# EAGLE schematic Training_Board (EAGLE 9.1.1)
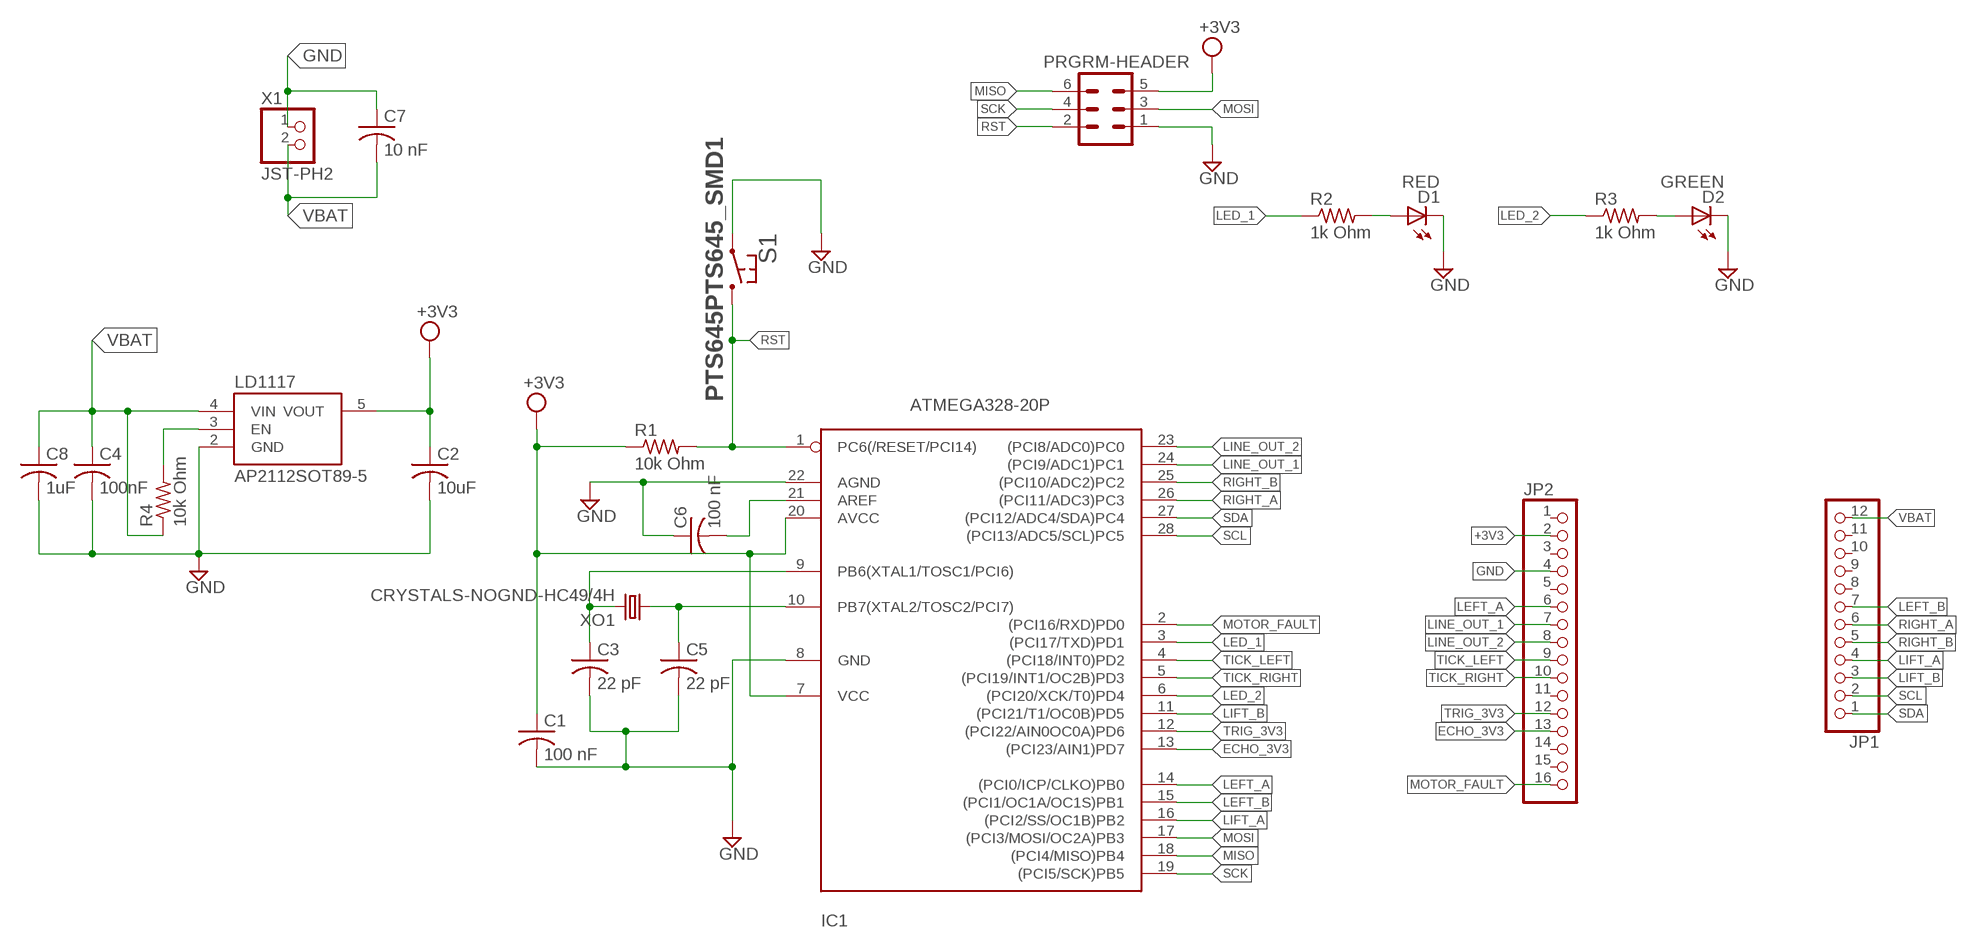
[diagram p0: schematic, sheet 1]

## Parts
C1  100 nF  C-USC0603  [C0603]
C2  10uF  C-USC0603  [C0603]
C3  22 pF  C-USC0603  [C0603]
C4  100nF  C-USC0603  [C0603]
C5  22 pF  C-USC0603  [C0603]
C6  100 nF  C-USC0603  [C0603]
C7  10 nF  C-USC0603  [C0603]
C8  1uF  C-USC0603  [C0603]
D1  RED  LEDCHIP-LED0603  [CHIP-LED0603]
D2  GREEN  LEDCHIP-LED0603  [CHIP-LED0603]
IC1  ATMEGA328-20P  [DIL28-3]
JP1  PINHD-1X12  [1X12]
JP2  PINHD-1X16  [1X16]
LD1117  AP2112SOT89-5  [SOT95P285X110-5]
PRGRM-HEADER  MA03-2  [MA03-2]
R1  10k Ohm  R-US_R0603  [R0603]
R2  1k Ohm  R-US_M0805  [M0805]
R3  1k Ohm  R-US_M0805  [M0805]
R4  10k Ohm  R-US_M0805  [M0805]
S1  PTS645PTS645_SMD1  [PTS645_SMD]
X1  JST-PH2  [JST-PH]
XO1  CRYSTALS-NOGND-HC49/4H  [HC49]

## Nets
+3V3: C1.1 C2.1 IC1.7(VCC) IC1.20(AVCC) JP2.2 LD1117.5(VOUT) PRGRM-HEADER.5 R1.1
ECHO_3V3: IC1.13((PCI23/AIN1)PD7) JP2.13
GND: C1.2 C2.2 C3.2 C4.2 C5.2 C6.1 C7.1 C8.2 D1.C D2.C IC1.8(GND) IC1.22(AGND) JP2.4 LD1117.2(GND) PRGRM-HEADER.1 S1.P$1 S1.P$2 X1.1
LED_1: IC1.3((PCI17/TXD)PD1) R2.1
LED_2: IC1.6((PCI20/XCK/T0)PD4) R3.1
LEFT_A: IC1.14((PCI0/ICP/CLKO)PB0) JP2.6
LEFT_B: IC1.15((PCI1/OC1A/OC1S)PB1) JP1.7
LIFT_A: IC1.16((PCI2/SS/OC1B)PB2) JP1.4
LIFT_B: IC1.11((PCI21/T1/OC0B)PD5) JP1.3
LINE_OUT_1: IC1.24((PCI9/ADC1)PC1) JP2.7
LINE_OUT_2: IC1.23((PCI8/ADC0)PC0) JP2.8
MISO: IC1.18((PCI4/MISO)PB4) PRGRM-HEADER.6
MOSI: IC1.17((PCI3/MOSI/OC2A)PB3) PRGRM-HEADER.3
MOTOR_FAULT: IC1.2((PCI16/RXD)PD0) JP2.16
N$1: C3.1 IC1.9(PB6(XTAL1/TOSC1/PCI6)) XO1.2
N$2: D2.A R3.2
N$3: D1.A R2.2
N$4: C5.1 IC1.10(PB7(XTAL2/TOSC2/PCI7)) XO1.1
N$5: LD1117.3(EN) R4.2
N$6: C6.2 IC1.21(AREF)
RIGHT_A: IC1.26((PCI11/ADC3)PC3) JP1.6
RIGHT_B: IC1.25((PCI10/ADC2)PC2) JP1.5
RST: IC1.1(PC6(/RESET/PCI14)) PRGRM-HEADER.2 R1.2 S1.P$3 S1.P$4
SCK: IC1.19((PCI5/SCK)PB5) PRGRM-HEADER.4
SCL: IC1.28((PCI13/ADC5/SCL)PC5) JP1.2
SDA: IC1.27((PCI12/ADC4/SDA)PC4) JP1.1
TICK_LEFT: IC1.4((PCI18/INT0)PD2) JP2.9
TICK_RIGHT: IC1.5((PCI19/INT1/OC2B)PD3) JP2.10
TRIG_3V3: IC1.12((PCI22/AIN0OC0A)PD6) JP2.12
VBAT: C4.1 C7.2 C8.1 JP1.12 LD1117.4(VIN) R4.1 X1.2
Unconnected: JP1.8 JP1.9 JP1.10 JP1.11 JP2.1 JP2.3 JP2.5 JP2.11 JP2.14 JP2.15

## Library data of the parts
C1 C3 C5-C7 = resistor:C-US: CAPACITOR, American symbol
C2 C4 C8 = rcl:C-US: CAPACITOR, American symbol; SPICEPREFIX: C
D1 D2 = led:LED: LED OSRAM: - CHIPLED LG R971, LG N971, LY N971, LG Q971, LY Q971, LO R971, LY R971 LH N974, LH R974 LS Q976, LO Q976, LY Q976 LO Q996 - Hyper CHIPLED LW Q18S LB Q993, LB Q99A, LB R99A - SideLED LS A670, LO A670, LY A670, LG A670, LP A670 LB A673, LV A673, LT A673, LW A673 LH A674 LY A675 LS A676, LA A676, LO A676, LY A676, LW A676 LS A679, LY A679, LG A679 - Hyper Micro SIDELED® LS Y876, LA Y876, LO Y876, LY Y876 LT Y87S - SmartLED LW L88C, LW L88S LB L89C, LB L89S, LG L890 LS L89K, LO L89K, LY L89K LS L896, LA L896, LO L896, LY L896 - TOPLED LS T670, LO T670, LY T670, LG T670, LP T670 LSG T670, LSP T670, LSY T670, LOP T670, LYG T670 LG T671, LOG T671, LSG T671 LB T673, LV T673, LT T673, LW T673 LH T674 LS T676, LA T676, LO T676, LY T676, LB T676, LH T676, LSB T676, LW T676 LB T67C, LV T67C, LT T67C, LS T67K, LO T67K, LY T67K, LW E67C LS E67B, LA E67B, LO E67B, LY E67B, LB E67C, LV E67C, LT E67C LW T67C LS T679, LY T679, LG T679 LS T770, LO T770, LY T770, LG T770, LP T770 LB T773, LV T773, LT T773, LW T773 LH T774 LS E675, LA E675, LY E675, LS T675 LS T776, LA T776, LO T776, LY T776, LB T776 LHGB T686 LT T68C, LB T68C - Hyper Mini TOPLED® LB M676 - Mini TOPLED Santana® LG M470 LS M47K, LO M47K, LY M47K Source: http://www.osram.convergy.de LUXEON: - LUMILED® LXK2-PW12-R00, LXK2-PW12-S00, LXK2-PW14-U00, LXK2-PW14-V00 LXK2-PM12-R00, LXK2-PM12-S00, LXK2-PM14-U00 LXK2-PE12-Q00, LXK2-PE12-R00, LXK2-PE12-S00, LXK2-PE14-T00, LXK2-PE14-U00 LXK2-PB12-K00, LXK2-PB12-L00, LXK2-PB12-M00, LXK2-PB14-N00, LXK2-PB14-P00, LXK2-PB14-Q00 LXK2-PR12-L00, LXK2-PR12-M00, LXK2-PR14-Q00, LXK2-PR14-R00 LXK2-PD12-Q00, LXK2-PD12-R00, LXK2-PD12-S00 LXK2-PH12-R00, LXK2-PH12-S00 LXK2-PL12-P00, LXK2-PL12-Q00, LXK2-PL12-R00 Source: www.luxeon.com KINGBRIGHT: KA-3528ASYC Source: www.kingbright.com
IC1 = atmega328:ATMEGA328*P: MICROCONTROLLER 32 kBytes FLASH 2 kBytes SRAM 1 kBytes EEPROM USART 8-channel 10 bit ADC
JP1 = pinhead:PINHD-1X12: PIN HEADER
JP2 = pinhead:PINHD-1X16: PIN HEADER
LD1117 = RoboJackets-PowerICs:AP2112
PRGRM-HEADER = con-lstb:MA03-2: PIN HEADER; OC_FARNELL: unknown; OC_NEWARK: unknown
R1 = resistor:R-US_: RESISTOR, American symbol
R2-R4 = rcl:R-US_: RESISTOR, American symbol; SPICEPREFIX: R
S1 = RoboJackets-Switches:PTS645: Tactile Momentary Pushbutton with thru-hole legs. https://www.ckswitches.com/media/1471/pts645.pdf
X1 = Trainii:JST-PH2
XO1 = IQD-Frequency-Products:CRYSTALS-NOGND: CRYSTALS CAN NOT GROUNDED